# EAGLE schematic untitled (EAGLE 9.5.2)
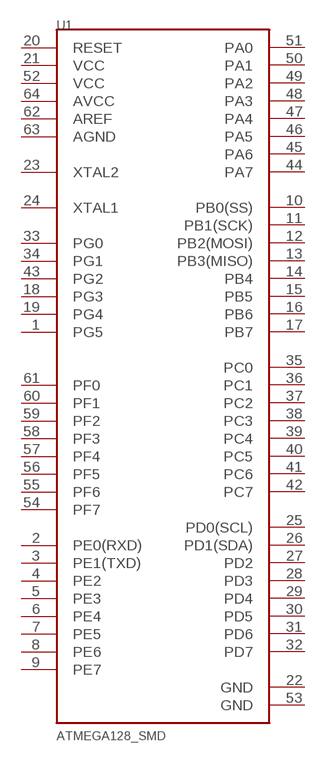
[diagram p0: schematic, sheet 1]

## Parts
U1  ATMEGA128_SMD  [TQFP64]
Unconnected: U1.1(PG5) U1.2(PE0(RXD)) U1.3(PE1(TXD)) U1.4(PE2) U1.5(PE3) U1.6(PE4) U1.7(PE5) U1.8(PE6) U1.9(PE7) U1.10(PB0(SS)) U1.11(PB1(SCK)) U1.12(PB2(MOSI)) U1.13(PB3(MISO)) U1.14(PB4) U1.15(PB5) U1.16(PB6) U1.17(PB7) U1.18(PG3) U1.19(PG4) U1.20(RESET) U1.21(VCC) U1.22(GND) U1.23(XTAL2) U1.24(XTAL1) U1.25(PD0(SCL)) U1.26(PD1(SDA)) U1.27(PD2) U1.28(PD3) U1.29(PD4) U1.30(PD5) U1.31(PD6) U1.32(PD7) U1.33(PG0) U1.34(PG1) U1.35(PC0) U1.36(PC1) U1.37(PC2) U1.38(PC3) U1.39(PC4) U1.40(PC5) U1.41(PC6) U1.42(PC7) U1.43(PG2) U1.44(PA7) U1.45(PA6) U1.46(PA5) U1.47(PA4) U1.48(PA3) U1.49(PA2) U1.50(PA1) U1.51(PA0) U1.52(VCC) U1.53(GND) U1.54(PF7) U1.55(PF6) U1.56(PF5) U1.57(PF4) U1.58(PF3) U1.59(PF2) U1.60(PF1) U1.61(PF0) U1.62(AREF) U1.63(AGND) U1.64(AVCC)

## Library data of the parts
U1 = SparkFun-IC-Microcontroller:ATMEGA128: ATmega 128 ATmega128/128L/1281/2561. Note: The ATmega128 pin 1 is PEN and the ATmega256/1281 pin 1 is PG5. Not in catalog